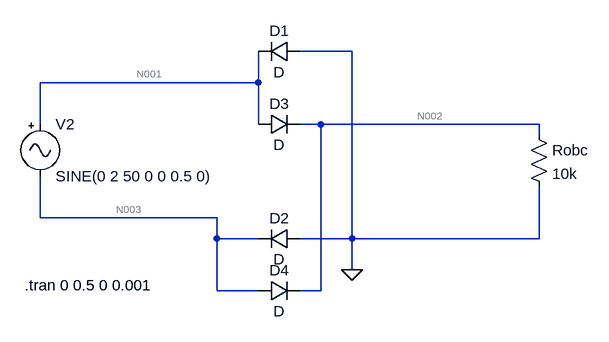
[diagram p0: schematic schemat.asc]
schemat.asc, the LTspice schematic file:
Version 4
SHEET 1 880 680
WIRE 336 -64 256 -64
WIRE 192 -16 192 -64
WIRE 192 -16 -144 -16
WIRE -144 48 -144 -16
WIRE 192 48 192 -16
WIRE 288 48 256 48
WIRE 624 48 288 48
WIRE 624 64 624 48
WIRE -144 192 -144 128
WIRE 128 192 -144 192
WIRE 128 224 128 192
WIRE 192 224 128 224
WIRE 336 224 336 -64
WIRE 336 224 256 224
WIRE 624 224 624 144
WIRE 624 224 336 224
WIRE 336 272 336 224
WIRE 128 304 128 224
WIRE 192 304 128 304
WIRE 288 304 288 48
WIRE 288 304 256 304
FLAG 336 272 0
SYMBOL Misc\\signal -144 32 R0
WINDOW 123 0 0 Left 0
WINDOW 39 0 0 Left 0
SYMATTR InstName V2
SYMATTR Value SINE(0 2 50 0 0 0.5 0)
SYMBOL res 608 48 R0
SYMATTR InstName Robc
SYMATTR Value 10k
SYMBOL diode 256 -80 R90
WINDOW 0 0 32 VBottom 2
WINDOW 3 32 32 VTop 2
SYMATTR InstName D1
SYMBOL diode 256 208 R90
WINDOW 0 0 32 VBottom 2
WINDOW 3 32 32 VTop 2
SYMATTR InstName D2
SYMBOL diode 192 64 R270
WINDOW 0 32 32 VTop 2
WINDOW 3 0 32 VBottom 2
SYMATTR InstName D3
SYMBOL diode 192 320 R270
WINDOW 0 32 32 VTop 2
WINDOW 3 0 32 VBottom 2
SYMATTR InstName D4
TEXT -168 296 Left 2 !.tran 0 0.5 0 0.001

The netlist it stands for:
* schemat.asc
V2 N001 N003 SINE(0 2 50 0 0 0.5 0)
Robc N002 0 10k
D1 0 N001 D
D2 0 N003 D
D3 N001 N002 D
D4 N003 N002 D
.model D D
.lib standard.dio
.tran 0 0.5 0 0.001
.backanno
.end

* Results of the author's LTspice run, read from the files saved beside the schematic
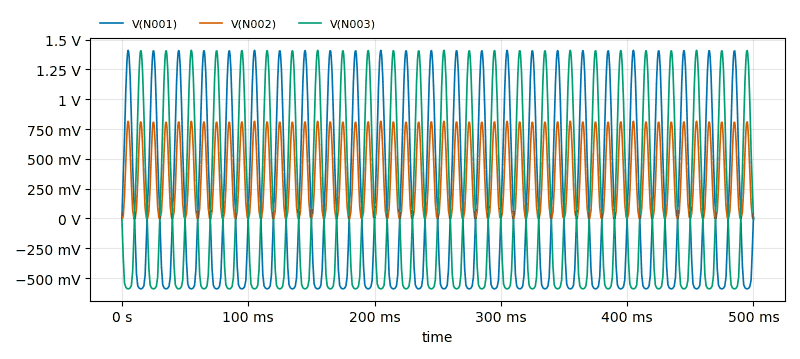
[diagram p1: Transient Analysis of schemat.asc, plotted from the saved traces]
* Transient Analysis, 1 run:
*   V(N001): min -590.4 mV, max 1.41 V, average 171.8 mV, rms 747.4 mV, last 8.727 mV
*   V(N002): min 0 V, max 814.7 mV, average 353.6 mV, rms 465.6 mV, last 0 V
*   V(N003): min -590.4 mV, max 1.41 V, average 171.8 mV, rms 747.5 mV, last -8.727 mV